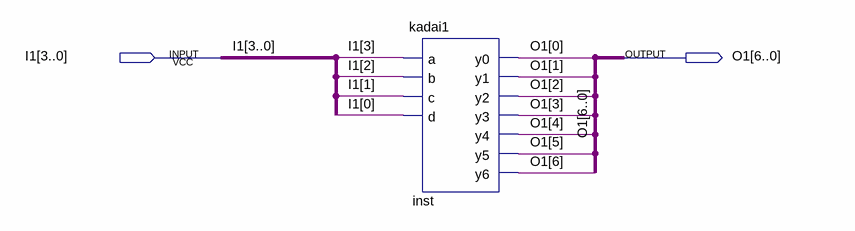
[diagram p0: schematic sheet]
// Quartus schematic kadai1-2.bdf as structural Verilog: 1 symbols, 2 pins
module \kadai1-2  (
  input  [3:0] I1,
  output [6:0] O1
);

  kadai1 inst (
    .a(I1[3]), .b(I1[2]), .c(I1[1]), .d(I1[0]), .y0(O1[0]), .y1(O1[1]), .y2(O1[2]), .y3(O1[3]), .y4(O1[4]),
    .y5(O1[5]), .y6(O1[6]));
endmodule
